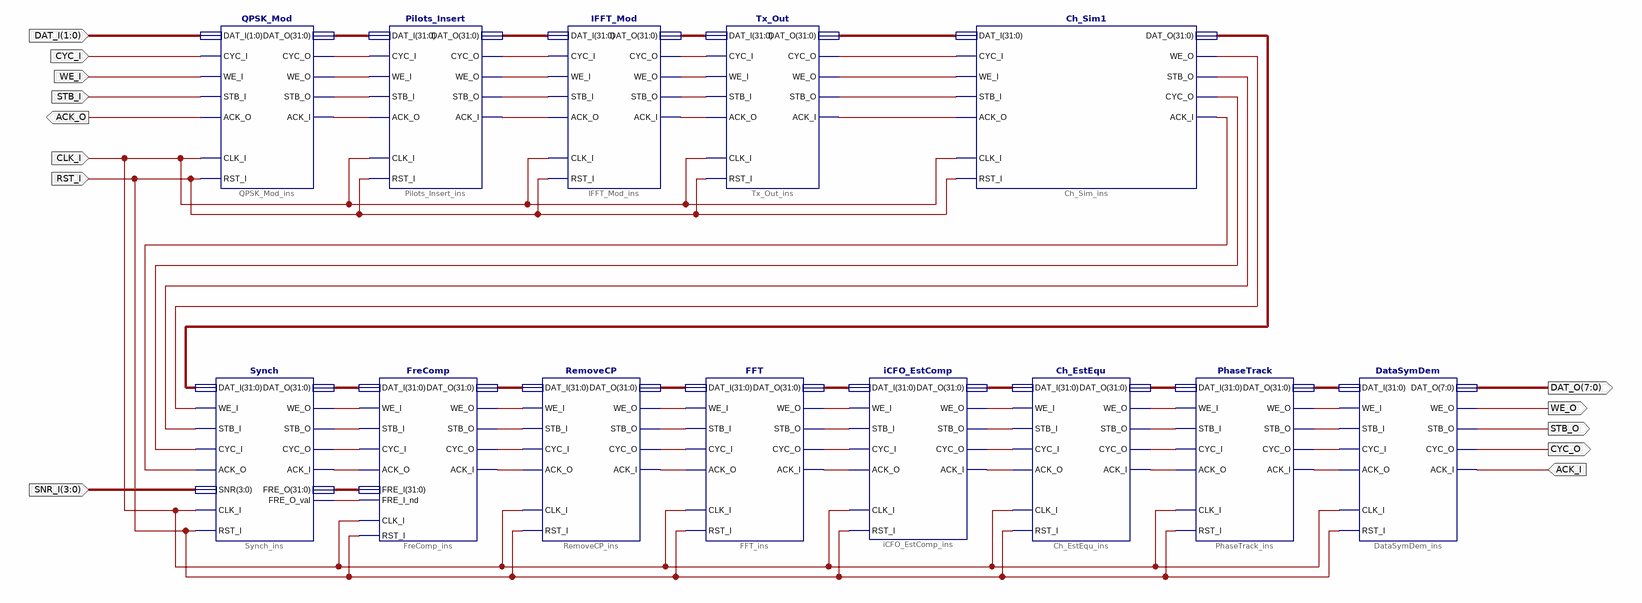
[diagram p0: schematic sheet 1]
// Xilinx ISE schematic OFDM_SYS.sch (spartan6) as structural Verilog: 13 symbols, 13 ports
module OFDM_SYS (
  input  [1:0] DAT_I,
  input  CYC_I,
  input  WE_I,
  input  STB_I,
  input  CLK_I,
  input  RST_I,
  input  ACK_I,
  input  [3:0] SNR_I,
  output ACK_O,
  output [7:0] DAT_O,
  output WE_O,
  output STB_O,
  output CYC_O
);

  wire XLXN_2, XLXN_3, XLXN_4, XLXN_5, XLXN_7, XLXN_8, XLXN_9, XLXN_10, XLXN_12, XLXN_13, XLXN_14, XLXN_15,
       XLXN_16, XLXN_17, XLXN_18, XLXN_19, XLXN_22, XLXN_23, XLXN_24, XLXN_25, XLXN_26, XLXN_28, XLXN_29,
       XLXN_30, XLXN_32, XLXN_33, XLXN_34, XLXN_35, XLXN_36, XLXN_38, XLXN_39, XLXN_40, XLXN_42, XLXN_43,
       XLXN_44, XLXN_45, XLXN_46, XLXN_48, XLXN_49, XLXN_50, XLXN_52, XLXN_79, XLXN_98, XLXN_675, XLXN_676,
       XLXN_677, XLXN_678, XLXN_683, XLXN_684;
  wire [31:0] XLXN_1, XLXN_6, XLXN_11, XLXN_20, XLXN_21, XLXN_27, XLXN_31, XLXN_37, XLXN_41, XLXN_47,
       XLXN_51, XLXN_97, XLXN_679;

  QPSK_Mod QPSK_Mod_ins (
    .DAT_I(DAT_I), .CYC_I(CYC_I), .WE_I(WE_I), .STB_I(STB_I), .RST_I(RST_I), .ACK_O(ACK_O), .DAT_O(XLXN_1),
    .CYC_O(XLXN_2), .WE_O(XLXN_3), .STB_O(XLXN_4), .ACK_I(XLXN_5), .CLK_I(CLK_I));
  Pilots_Insert Pilots_Insert_ins (
    .DAT_I(XLXN_1), .CYC_I(XLXN_2), .WE_I(XLXN_3), .STB_I(XLXN_4), .CLK_I(CLK_I), .RST_I(RST_I),
    .CYC_O(XLXN_7), .STB_O(XLXN_9), .WE_O(XLXN_8), .DAT_O(XLXN_6), .ACK_I(XLXN_10), .ACK_O(XLXN_5));
  IFFT_Mod IFFT_Mod_ins (
    .DAT_I(XLXN_6), .CYC_I(XLXN_7), .WE_I(XLXN_8), .STB_I(XLXN_9), .CYC_O(XLXN_14), .STB_O(XLXN_13),
    .WE_O(XLXN_12), .ACK_I(XLXN_15), .ACK_O(XLXN_10), .DAT_O(XLXN_11), .CLK_I(CLK_I), .RST_I(RST_I));
  Synch Synch_ins (
    .ACK_I(XLXN_22), .WE_O(XLXN_16), .STB_O(XLXN_17), .CYC_O(XLXN_18), .FRE_O_val(XLXN_19), .DAT_O(XLXN_20),
    .FRE_O(XLXN_21), .DAT_I(XLXN_97), .CLK_I(CLK_I), .RST_I(RST_I), .SNR(SNR_I), .ACK_O(XLXN_79),
    .WE_I(XLXN_98), .STB_I(XLXN_683), .CYC_I(XLXN_684));
  RemoveCP RemoveCP_ins (
    .CLK_I(CLK_I), .RST_I(RST_I), .WE_I(XLXN_26), .STB_I(XLXN_25), .CYC_I(XLXN_24), .ACK_I(XLXN_32),
    .DAT_I(XLXN_27), .ACK_O(XLXN_23), .CYC_O(XLXN_30), .STB_O(XLXN_29), .WE_O(XLXN_28), .DAT_O(XLXN_31));
  iCFO_EstComp iCFO_EstComp_ins (
    .CLK_I(CLK_I), .RST_I(RST_I), .WE_I(XLXN_36), .STB_I(XLXN_35), .CYC_I(XLXN_34), .ACK_I(XLXN_42),
    .DAT_I(XLXN_37), .ACK_O(XLXN_33), .CYC_O(XLXN_40), .STB_O(XLXN_39), .WE_O(XLXN_38), .DAT_O(XLXN_41));
  PhaseTrack PhaseTrack_ins (
    .CLK_I(CLK_I), .RST_I(RST_I), .WE_I(XLXN_46), .STB_I(XLXN_45), .CYC_I(XLXN_44), .ACK_I(XLXN_52),
    .DAT_I(XLXN_47), .ACK_O(XLXN_43), .CYC_O(XLXN_50), .STB_O(XLXN_49), .WE_O(XLXN_48), .DAT_O(XLXN_51));
  FreComp FreComp_ins (
    .CLK_I(CLK_I), .RST_I(RST_I), .WE_I(XLXN_16), .STB_I(XLXN_17), .CYC_I(XLXN_18), .FRE_I_nd(XLXN_19),
    .ACK_I(XLXN_23), .DAT_I(XLXN_20), .FRE_I(XLXN_21), .ACK_O(XLXN_22), .CYC_O(XLXN_24), .STB_O(XLXN_25),
    .WE_O(XLXN_26), .DAT_O(XLXN_27));
  FFT FFT_ins (
    .CLK_I(CLK_I), .RST_I(RST_I), .WE_I(XLXN_28), .STB_I(XLXN_29), .CYC_I(XLXN_30), .ACK_I(XLXN_33),
    .DAT_I(XLXN_31), .ACK_O(XLXN_32), .CYC_O(XLXN_34), .STB_O(XLXN_35), .WE_O(XLXN_36), .DAT_O(XLXN_37));
  Ch_EstEqu Ch_EstEqu_ins (
    .CLK_I(CLK_I), .RST_I(RST_I), .WE_I(XLXN_38), .STB_I(XLXN_39), .CYC_I(XLXN_40), .ACK_I(XLXN_43),
    .DAT_I(XLXN_41), .ACK_O(XLXN_42), .CYC_O(XLXN_44), .STB_O(XLXN_45), .WE_O(XLXN_46), .DAT_O(XLXN_47));
  DataSymDem DataSymDem_ins (
    .CLK_I(CLK_I), .RST_I(RST_I), .WE_I(XLXN_48), .STB_I(XLXN_49), .CYC_I(XLXN_50), .ACK_I(ACK_I),
    .DAT_I(XLXN_51), .ACK_O(XLXN_52), .CYC_O(CYC_O), .STB_O(STB_O), .WE_O(WE_O), .DAT_O(DAT_O));
  Ch_Sim1 Ch_Sim_ins (
    .WE_I(XLXN_677), .STB_I(XLXN_676), .DAT_I(XLXN_679), .CYC_I(XLXN_675), .ACK_O(XLXN_678), .DAT_O(XLXN_97),
    .ACK_I(XLXN_79), .CLK_I(CLK_I), .RST_I(RST_I), .STB_O(XLXN_683), .WE_O(XLXN_98), .CYC_O(XLXN_684));
  Tx_Out Tx_Out_ins (
    .DAT_I(XLXN_11), .WE_I(XLXN_12), .STB_I(XLXN_13), .CYC_I(XLXN_14), .CLK_I(CLK_I), .RST_I(RST_I),
    .CYC_O(XLXN_675), .STB_O(XLXN_676), .WE_O(XLXN_677), .ACK_I(XLXN_678), .ACK_O(XLXN_15), .DAT_O(XLXN_679));
endmodule
